# EasyEDA Pro project CTRL Paws.eprj

# Schematic Schematic1
Board Name: Board1; Create Date: 2026-03-21; Page Name: P1; Project Name: CTRL Paws; Schematic Name: Schematic1; Update Date: 2026-05-06; Company: EasyEDA.com; Page Size: A4; Version: V1.0
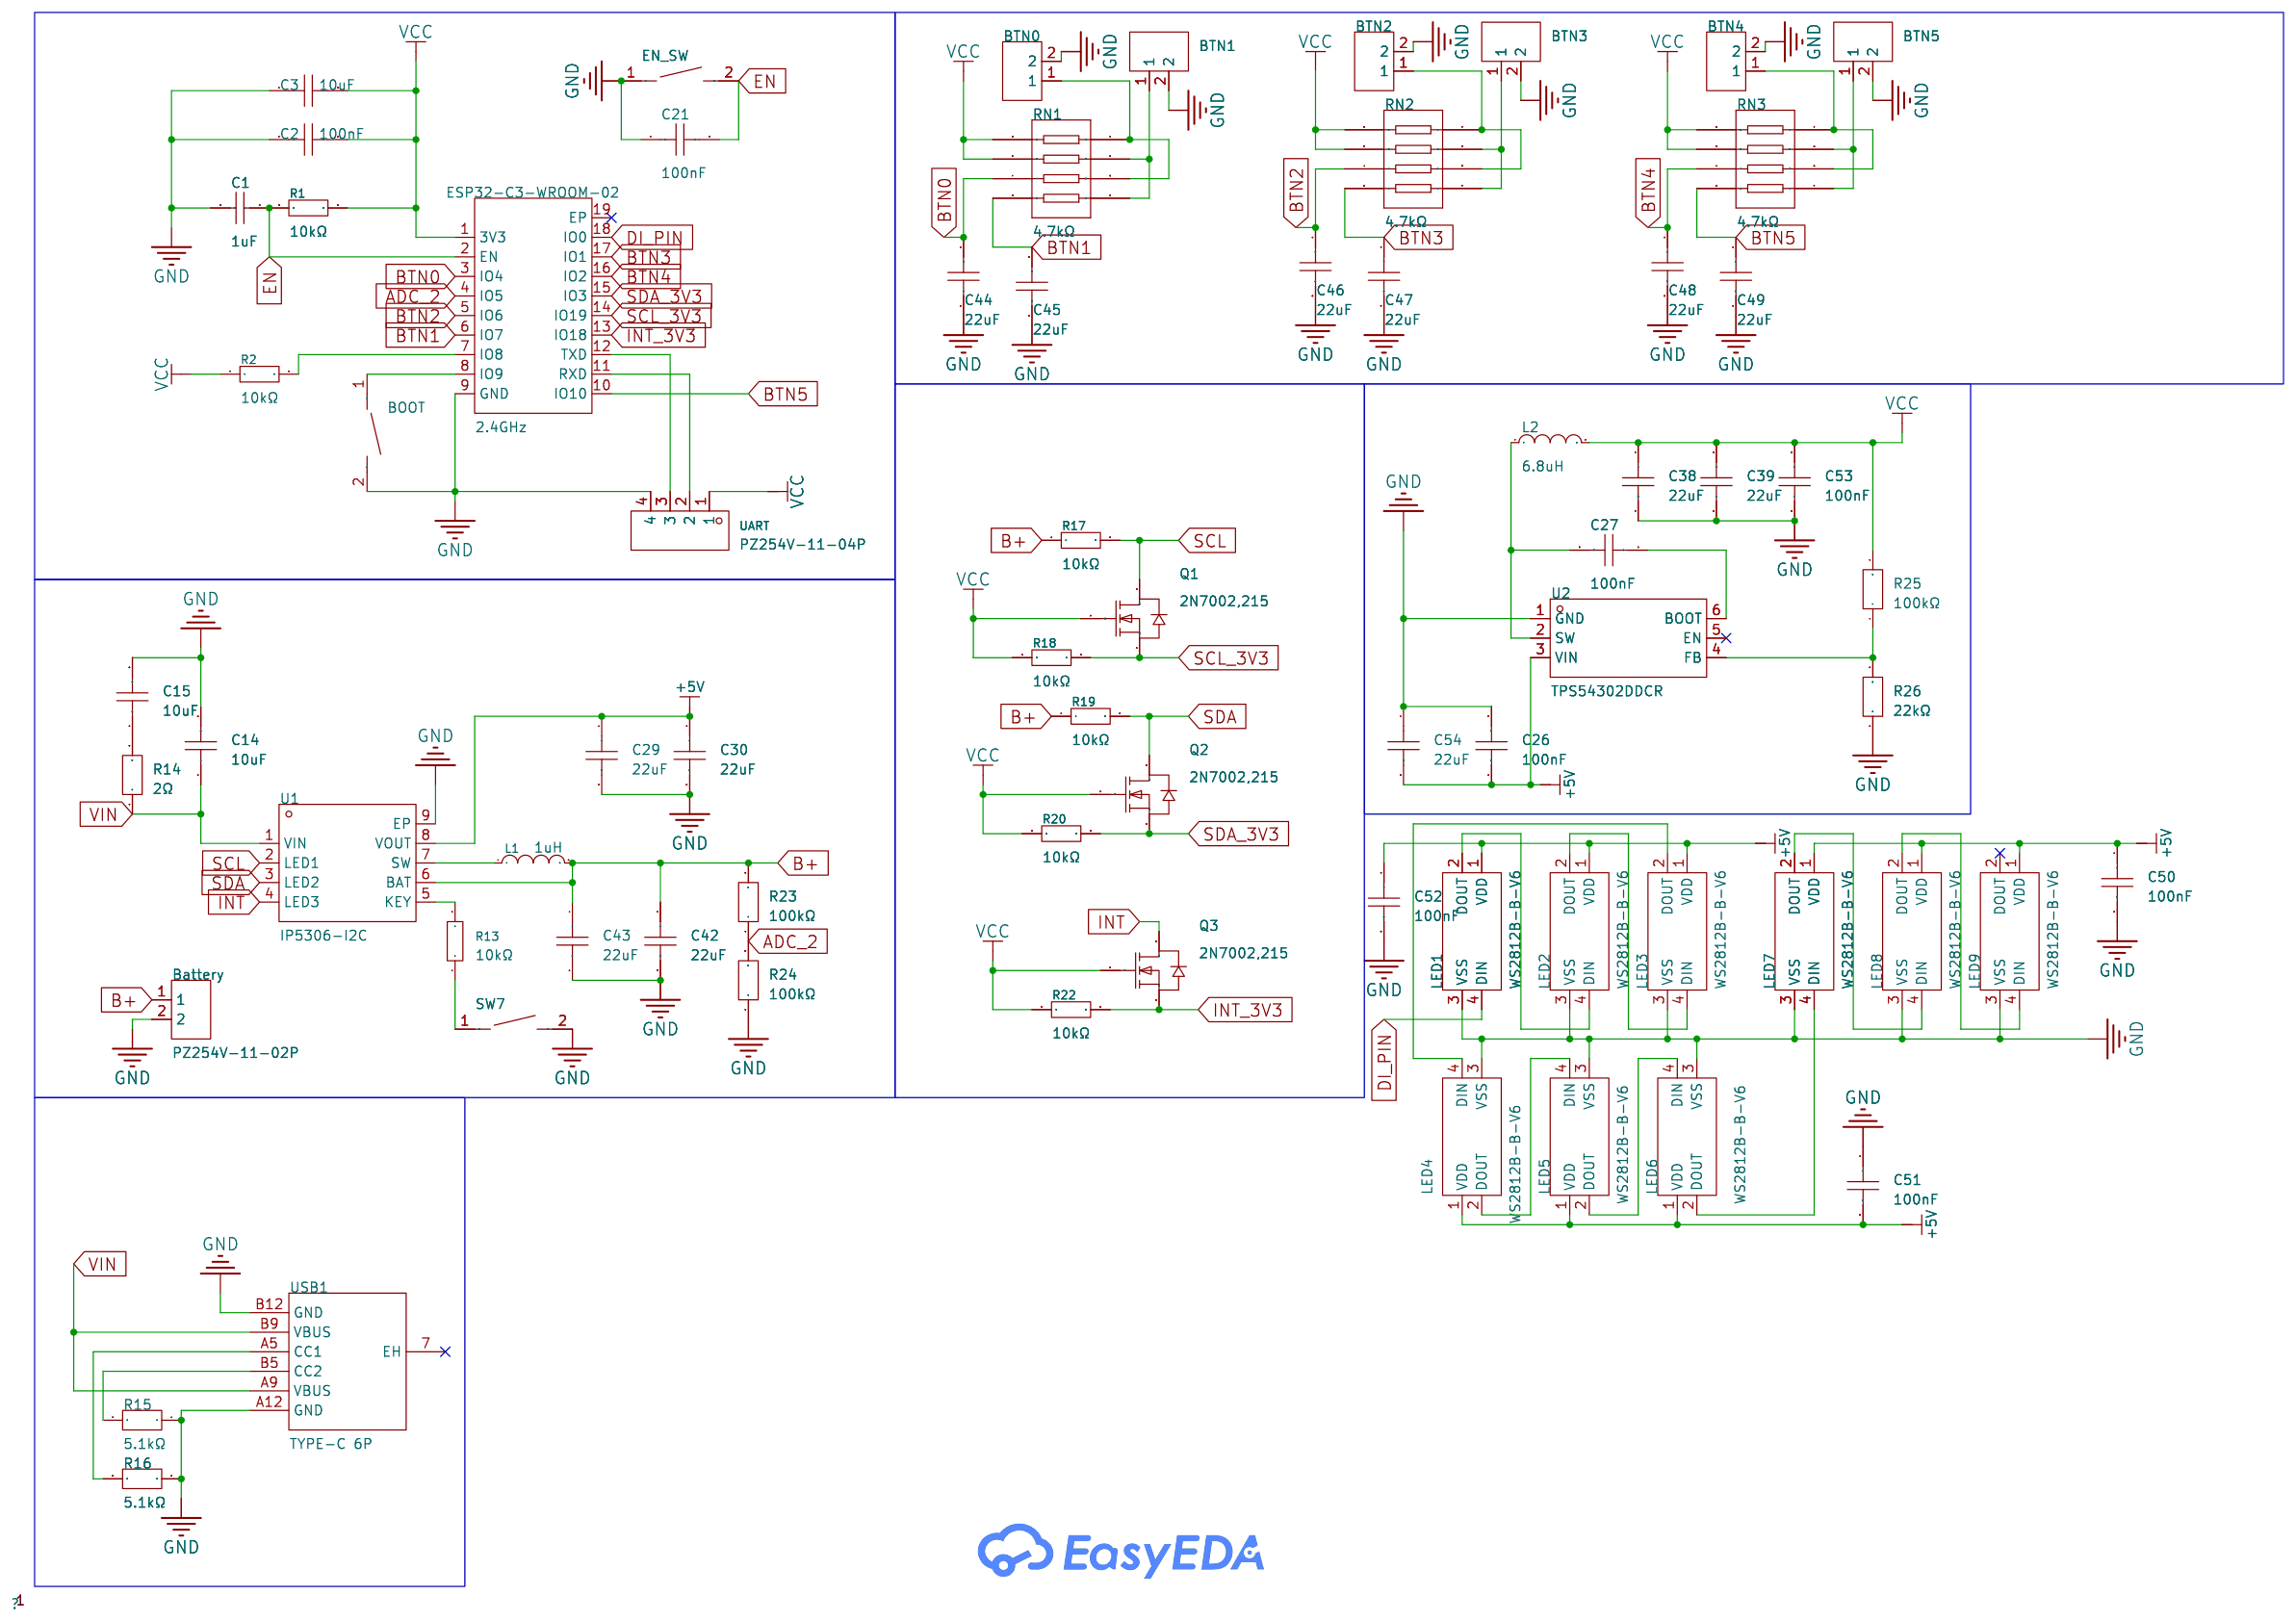
[diagram p0: schematic sheet]

## Parts
Battery  PZ254V-11-02P  [HDR-TH_2P-P2.54-V-M]
BOOT  TSA06154-050B832BA  [SW-TH_L6.1-W6.1-P5.00]
BTN0  PZ254V-11-02P  [HDR-TH_2P-P2.54-V-M]
BTN1  PZ254V-11-02P  [HDR-TH_2P-P2.54-V-M]
BTN2  PZ254V-11-02P  [HDR-TH_2P-P2.54-V-M]
BTN3  PZ254V-11-02P  [HDR-TH_2P-P2.54-V-M]
BTN4  PZ254V-11-02P  [HDR-TH_2P-P2.54-V-M]
BTN5  PZ254V-11-02P  [HDR-TH_2P-P2.54-V-M]
C1  1uF  [C0603]
C2  100nF  [C1206]
C3  10uF  [C0603]
C14  10uF  [C0603]
C15  10uF  [C0603]
C21  100nF  [C1206]
C26  100nF  [C1206]
C27  100nF  [C1206]
C29  22uF  [C0603]
C30  22uF  [C0603]
C38  22uF  [C0603]
C39  22uF  [C0603]
C42  22uF  [C0603]
C43  22uF  [C0603]
C44  22uF  [C0603]
C45  22uF  [C0603]
C46  22uF  [C0603]
C47  22uF  [C0603]
C48  22uF  [C0603]
C49  22uF  [C0603]
C50  100nF  [C1206]
C51  100nF  [C1206]
C52  100nF  [C1206]
C53  100nF  [C1206]
C54  22uF  [C0603]
EN_SW  TSA06154-050B832BA  [SW-TH_L6.1-W6.1-P5.00]
ESP32-C3-WROOM-02  2.4GHz  [BULETM-SMD_ESPRESSIF_ESP32-C3-WROOM-02-N4-4MB]
L1  1uH  [IND-SMD_L7.2-W6.6_GPSR07X0]
L2  6.8uH  [IND-SMD_L5.6-W5.2_DH0530H-100M]
LED1  WS2812B-B-V6  [LED-SMD_4P-L5.0-W5.0-TL_WS2812B-B]
LED2  WS2812B-B-V6  [LED-SMD_4P-L5.0-W5.0-TL_WS2812B-B]
LED3  WS2812B-B-V6  [LED-SMD_4P-L5.0-W5.0-TL_WS2812B-B]
LED4  WS2812B-B-V6  [LED-SMD_4P-L5.0-W5.0-TL_WS2812B-B]
LED5  WS2812B-B-V6  [LED-SMD_4P-L5.0-W5.0-TL_WS2812B-B]
LED6  WS2812B-B-V6  [LED-SMD_4P-L5.0-W5.0-TL_WS2812B-B]
LED7  WS2812B-B-V6  [LED-SMD_4P-L5.0-W5.0-TL_WS2812B-B]
LED8  WS2812B-B-V6  [LED-SMD_4P-L5.0-W5.0-TL_WS2812B-B]
LED9  WS2812B-B-V6  [LED-SMD_4P-L5.0-W5.0-TL_WS2812B-B]
Q1  2N7002,215  [SOT-23_L2.9-W1.3-P1.90-LS2.4-BR]
Q2  2N7002,215  [SOT-23_L2.9-W1.3-P1.90-LS2.4-BR]
Q3  2N7002,215  [SOT-23_L2.9-W1.3-P1.90-LS2.4-BR]
R1  10kΩ  [R1206]
R2  10kΩ  [R1206]
R13  10kΩ  [R1206]
R14  2Ω  [R1206]
R15  5.1kΩ  [R1206]
R16  5.1kΩ  [R1206]
R17  10kΩ  [R1206]
R18  10kΩ  [R1206]
R19  10kΩ  [R1206]
R20  10kΩ  [R1206]
R22  10kΩ  [R1206]
R23  100kΩ  [R0603]
R24  100kΩ  [R0603]
R25  100kΩ  [R0603]
R26  22kΩ  [R0603]
RN1  4.7kΩ  [RES-ARRAY-SMD_0603-8P-L3.2-W1.6-BL]
RN2  4.7kΩ  [RES-ARRAY-SMD_0603-8P-L3.2-W1.6-BL]
RN3  4.7kΩ  [RES-ARRAY-SMD_0603-8P-L3.2-W1.6-BL]
SW7  TSA06154-050B832BA  [SW-TH_L6.1-W6.1-P5.00]
U1  IP5306-I2C  [ESOP-8_L4.9-W3.9-P1.27-LS6.0-BL-EP2.0]
U2  TPS54302DDCR  [SOT-23-6_L2.9-W1.6-P0.95-LS2.8-BL]
UART  PZ254V-11-04P  [HDR-TH_4P-P2.54-V-M]
USB1  TYPE-C 6P  [TYPE-C-SMD_TYPE-C-6P_1]

## Library data of the parts
Battery BTN0-BTN5 = PZ254V-11-02P: LCSC Part Name: 1x2P 间距:2.54mm 方针 直插; Supplier Part: C492401; Manufacturer: XFCN(兴飞); Supplier Footprint: 插件,P=2.54mm; JLCPCB Part Class: Extended Part; Datasheet: https://item.szlcsc.com/datasheet/PZ254V-11-02P/502957.html; Supplier: LCSC; Pin Structure: 1x2P; Pitch: 2.54mm; Circluar Pins/Square Pins: Pin Header; Mounting Type: Through Hole; Number of Rows: 1; Number of Pins: 2P; Current Rating: 3A; Voltage Rating (Max): 250V; Length of Mating Pin: 6mm; Insulation Height: 2.5mm; Length of End Connection Pin: 3mm; Contact Material: Brass; Operating Temperature: -40℃~+105℃; Color: Black
BOOT EN_SW SW7 = TSA06154-050B832BA: LCSC Part Name: 6*6*5短两脚轻触开关250gf; Supplier Part: C49174414; Manufacturer: Khon(康宏电子); Supplier Footprint: 插件,6.1x6.1mm; JLCPCB Part Class: Extended Part; Datasheet: https://item.szlcsc.com/datasheet/TSA06154-050B832BA/51568440.html; Supplier: LCSC
C1 = CL10B105KO8NNNC: LCSC Part Name: 1uF ±10% 16V; Supplier Part: C59782; Manufacturer: SAMSUNG(三星); Supplier Footprint: 0603; JLCPCB Part Class: Extended Part; Datasheet: https://item.szlcsc.com/datasheet/CL10B105KO8NNNC/60834.html; Supplier: LCSC; Tolerance: ±10%; Voltage Rating: 16V; Temperature Coefficient: X7R
C2 C21 C26 C27 C50-C53 = CC1206KRX7R7BB104: LCSC Part Name: 100nF ±10% 16V; Supplier Part: C2180991; Manufacturer: YAGEO(国巨); Supplier Footprint: 1206; JLCPCB Part Class: Extended Part; Datasheet: https://item.szlcsc.com/datasheet/CC1206KRX7R7BB104/2273058.html; Supplier: LCSC; Tolerance: ±10%; Voltage Rating: 16V; Temperature Coefficient: X7R
C3 C14 C15 = CL10A106KO8NQNC: LCSC Part Name: 10uF ±10% 16V; Supplier Part: C962136; Manufacturer: SAMSUNG(三星); Supplier Footprint: 0603; JLCPCB Part Class: Extended Part; Datasheet: https://item.szlcsc.com/datasheet/CL10A106KO8NQNC/1043176.html; Supplier: LCSC; Tolerance: ±10%; Voltage Rating: 16V; Temperature Coefficient: X5R
C29 C30 C38 C39 C42-C49 C54 = CL10A226MO7JZNC: LCSC Part Name: 22uF ±20% 16V; Supplier Part: C2762594; Manufacturer: SAMSUNG(三星); Supplier Footprint: 0603; JLCPCB Part Class: Extended Part; Datasheet: https://item.szlcsc.com/datasheet/CL10A226MO7JZNC/2889856.html; Supplier: LCSC; Tolerance: ±20%; Voltage Rating: 16V; Temperature Coefficient: X5R
ESP32-C3-WROOM-02 = ESP32-C3-WROOM-02-N4_C2934560: LCSC Part Name: 不带固件 2.4GHz Wi-Fi（802.11b/g/n）+ 蓝牙5模组; Supplier Part: C2934560; Manufacturer: ESPRESSIF(乐鑫); Manufacturer Part: ESP32-C3-WROOM-02-N4; Supplier Footprint: VFQFN-32-EP; JLCPCB Part Class: Extended Part; Datasheet: https://item.szlcsc.com/datasheet/ESP32-C3-WROOM-02-N4/3281215.html; Supplier: LCSC; Utilized IC / Part: ESP32-C3 Chip; Wireless Standard: Bluetooth5.0; Interface Type: I2S；I2C；JTAG；UART；USB；SPI; Antenna Type: On-board PCB Antenna; Output Power: 20.5dBm; Voltage - Supply: 3V~3.6V; Receive  Current: 82mA; Send  Current: 345mA; Sensitivity: -105dBm; Operating Temperature: -40℃~+85℃
L1 = CYA0650-1.0UH: LCSC Part Name: 1uH ±20%; Supplier Part: C5189750; Manufacturer: SHOU HAN(首韩); Supplier Footprint: SMD,7.2x6.6mm; JLCPCB Part Class: Extended Part; Datasheet: https://atta.szlcsc.com/upload/public/pdf/source/20221010/325EA9F909CAF5AD1FA67C845DC4B396.pdf; Supplier: LCSC; Tolerance: ±20%
L2 = DH0530H-6R8M: LCSC Part Name: DH0530H-6R8M（6.8uH); Supplier Part: C41407037; Manufacturer: DH(德鸿感应); Supplier Footprint: SMD,5.6x5.2mm; JLCPCB Part Class: Extended Part; Datasheet: https://item.szlcsc.com/datasheet/DH0530H-6R8M/43206053.html; Supplier: LCSC; Tolerance: ±20%; Current Rating: 3A; Current - Saturation(Isat): 5A; DC Resistance(DCR): 70mΩ; Type: Molded Inductor
LED1-LED9 = WS2812B-B-V6: Supplier Part: C52941391; Manufacturer: worldsemi; Supplier Footprint: SMD5050-4P; JLCPCB Part Class: Extended Part; Datasheet: https://item.szlcsc.com/datasheet/WS2812B-B-V6/55856754.html; Supplier: LCSC
Q1-Q3 = 2N7002,215: LCSC Part Name: 1个N沟道 耐压:60V 电流:300mA; Supplier Part: C65189; Manufacturer: Nexperia(安世); Supplier Footprint: SOT-23; JLCPCB Part Class: Extended Part; Datasheet: https://item.szlcsc.com/datasheet/2N7002%252C215/66260.html; Supplier: LCSC; Number: 1 N-Channel; Drain to Source Voltage: 60V; Current - Continuous Drain(Id): 300mA; RDS(on): 5Ω@10V,500mA; Pd - Power Dissipation: 830mW; Gate Threshold Voltage (Vgs(th)): 2.5V; Input Capacitance(Ciss): 50pF@10V; Operating Temperature: -65℃~+150℃@(Tj)
R1 R2 R13 R17-R20 R22 = 1206W4F1002T5E: LCSC Part Name: 10kΩ ±1% 250mW 厚膜电阻; Supplier Part: C17902; Manufacturer: UNI-ROYAL(厚声); Supplier Footprint: 1206; JLCPCB Part Class: Basic Part; Datasheet: https://item.szlcsc.com/datasheet/1206W4F1002T5E/18590.html; Supplier: LCSC; Type: Thick Film Resistor; Tolerance: ±1%; Power(Watts): 250mW; Voltage-Supply(Max): 200V; Temperature Coefficient: ±100ppm/℃; Operating Temperature: -55℃~+155℃
R14 = FRC1206F2R00TS: LCSC Part Name: 2Ω ±1% 250mW 厚膜电阻; Supplier Part: C2907381; Manufacturer: FOJAN(富捷); Supplier Footprint: 1206; JLCPCB Part Class: Extended Part; Supplier: LCSC; Type: Thick Film Resistor; Tolerance: ±1%; Power(Watts): 250mW; Voltage-Supply(Max): 200V; Temperature Coefficient: ±200ppm/℃; Operating Temperature: -55℃~+155℃
R15 R16 = FRC1206J512 TS: LCSC Part Name: 5.1kΩ ±5% 250mW 厚膜电阻; Supplier Part: C2907509; Manufacturer: FOJAN(富捷); Supplier Footprint: 1206; JLCPCB Part Class: Extended Part; Supplier: LCSC; Type: Thick Film Resistor; Tolerance: ±5%; Power(Watts): 250mW; Voltage-Supply(Max): 200V; Temperature Coefficient: ±100ppm/℃; Operating Temperature: -55℃~+155℃
R23-R25 = FRC0603J104 TS: LCSC Part Name: 100kΩ ±5% 100mW 厚膜电阻; Supplier Part: C2907088; Manufacturer: FOJAN(富捷); Supplier Footprint: 0603; JLCPCB Part Class: Extended Part; Supplier: LCSC; Type: Thick Film Resistor; Tolerance: ±5%; Power(Watts): 100mW; Voltage-Supply(Max): 75V; Temperature Coefficient: ±100ppm/℃; Operating Temperature: -55℃~+155℃
R26 = FRC0603F2202TS: LCSC Part Name: 22kΩ ±1% 100mW 厚膜电阻; Supplier Part: C2907015; Manufacturer: FOJAN(富捷); Supplier Footprint: 0603; JLCPCB Part Class: Extended Part; Supplier: LCSC; Type: Thick Film Resistor; Tolerance: ±1%; Power(Watts): 100mW; Voltage-Supply(Max): 75V; Temperature Coefficient: ±100ppm/℃; Operating Temperature: -55℃~+155℃
RN1-RN3 = YC164-JR-074K7L: LCSC Part Name: 4.7kΩ ±5%; Supplier Part: C327044; Manufacturer: YAGEO(国巨); Supplier Footprint: 0603x4; JLCPCB Part Class: Extended Part; Datasheet: https://item.szlcsc.com/datasheet/YC164-JR-074K7L/307138.html; Supplier: LCSC; Tolerance: ±5%; Power(Watts): 62.5mW; Temperature Coefficient: ±200ppm/℃
U1 = IP5306-I2C: LCSC Part Name: 2.1A充电 2.4A放电高集成度移动电源SOC; Supplier Part: C488349; Manufacturer: INJOINIC(英集芯); Supplier Footprint: ESOP-8; JLCPCB Part Class: Extended Part; Datasheet: https://item.szlcsc.com/datasheet/IP5306-I2C/497969.html; Supplier: LCSC; The Chip Type: Charging IC; Voltage - Supply: 4.75V~5.5V; Charge Current - Max: 2.1A; Charging Saturation Voltage: 4.2V; Type of Battery: Lithium Battery; Operating Temperature: 0℃~+70℃; Battery Temperature Detection: Not supported; 0V Battery Charge: Not supported; Supply Current (Iq): 100uA; Interface: I2C; Features: Overcurrent Protection；Constant voltage charging；Constant current charging；Automatic recharge；Charge termination；Programmable charging current；Overvoltage protection；Over-discharge protection；Trickle charging；Short-Circuit  Protection
U2 = TPS54302DDCR_C311983: LCSC Part Name: 4.5V至28V输入、3A输出、EMI友好的同步降压转换器; Supplier Part: C311983; Manufacturer: TI(德州仪器); Supplier Footprint: TSOT-23-6; JLCPCB Part Class: Extended Part; Datasheet: https://www.ti.com/cn/lit/gpn/tps54302; Supplier: LCSC; Function: Step-down type; Output Type: Fixed; Input Voltage: 4.5V~28V; Output Voltage: 5V; Output Current: 3A; Switching Frequency: 400kHz; Operating Temperature: -40℃~+125℃; Synchronous Rectification: Yes; Number of Outputs: 1; Topology: Step-down; Quiescent Current (Iq): 45uA; Switch tube (built-in/external): Built-in
UART = PZ254V-11-04P: LCSC Part Name: 1x4P 间距:2.54mm 方针 直插; Supplier Part: C2691448; Manufacturer: XFCN(兴飞); Supplier Footprint: 插件,P=2.54mm; JLCPCB Part Class: Extended Part; Datasheet: https://item.szlcsc.com/datasheet/PZ254V-11-04P/2801085.html; Supplier: LCSC; Pin Structure: 1x4P; Pitch: 2.54mm; Circluar Pins/Square Pins: Pin Header; Mounting Type: Through Hole; Number of Rows: 1; Number of Pins: 4P; Current Rating: 3A; Voltage Rating (Max): 250V; Length of Mating Pin: 6mm; Insulation Height: 2.5mm; Length of End Connection Pin: 3mm; Operating Temperature: -40℃~+105℃; Color: Black
USB1 = TYPE-C 6P: LCSC Part Name: 6P卧贴母座; Supplier Part: C456012; Manufacturer: SHOU HAN(首韩); Supplier Footprint: SMD; JLCPCB Part Class: Extended Part; Datasheet: https://item.szlcsc.com/datasheet/TYPE-C%25206P/458819.html; Supplier: LCSC; Connector Type: Type-C; Gender: Female; Mounting Type: Surface Mount, Right Angle; Number of Contacts: 6P; Number of Ports: 1; Current Rating-Power: 3A; Voltage Rating: 5V; Connect-Disconnect Life: 3,000 Cycles; Detection color: Black; Operating Temperature: -40℃~+85℃

## Nets
+5V: C26.1 C29.1 C30.1 C50.1 C51.2 C52.1 C54.2 LED1.1(VDD) LED2.1(VDD) LED3.1(VDD) LED4.1(VDD) LED5.1(VDD) LED6.1(VDD) LED7.1(VDD) LED8.1(VDD) LED9.1(VDD) U1.8(VOUT) U2.3(VIN)
GND: Battery.2 BOOT.2 BTN0.2 BTN1.2 BTN2.2 BTN3.2 BTN4.2 BTN5.2 C1.1 C2.1 C3.1 C14.2 C15.2 C21.1 C26.2 C29.2 C30.2 C38.2 C39.2 C42.2 C43.2 C44.2 C45.2 C46.2 C47.2 C48.2 C49.2 C50.2 C51.1 C52.2 C53.1 C54.1 EN_SW.1 ESP32-C3-WROOM-02.9(GND) LED1.3(VSS) LED2.3(VSS) LED3.3(VSS) LED4.3(VSS) LED5.3(VSS) LED6.3(VSS) LED7.3(VSS) LED8.3(VSS) LED9.3(VSS) R15.1 R16.1 R24.1 R26.1 SW7.2 U1.9(EP) U2.1(GND) UART.4 USB1.A12(GND) USB1.B12(GND)
VCC: C2.2 C3.2 C38.1 C39.1 C53.2 ESP32-C3-WROOM-02.1(3V3) L2.2 Q1.1(G) Q2.1(G) Q3.1(G) R1.2 R2.1 R18.1 R20.1 R22.1 R25.2 RN1.5 RN1.6 RN2.5 RN2.6 RN3.5 RN3.6 UART.1
VIN: C14.1 R14.1 U1.1(VIN) USB1.A9(VBUS) USB1.B9(VBUS)
ADC_2: ESP32-C3-WROOM-02.4(IO5) R23.1 R24.2
B+: Battery.1 C42.1 C43.1 L1.2 R17.1 R19.1 R23.2 U1.6(BAT)
BTN0: C44.1 ESP32-C3-WROOM-02.3(IO4) RN1.7
BTN1: C45.1 ESP32-C3-WROOM-02.6(IO7) RN1.8
BTN2: C46.1 ESP32-C3-WROOM-02.5(IO6) RN2.7
BTN3: C47.1 ESP32-C3-WROOM-02.17(IO1) RN2.8
BTN4: C48.1 ESP32-C3-WROOM-02.16(IO2) RN3.7
BTN5: C49.1 ESP32-C3-WROOM-02.10(IO10) RN3.8
DI_PIN: ESP32-C3-WROOM-02.18(IO0) LED1.4(DIN)
EN: C1.2 C21.2 EN_SW.2 ESP32-C3-WROOM-02.2(EN) R1.1
INT: Q3.3(D) U1.4(LED3)
INT_3V3: ESP32-C3-WROOM-02.13(IO18) Q3.2(S) R22.2
SCL: Q1.3(D) R17.2 U1.2(LED1)
SCL_3V3: ESP32-C3-WROOM-02.14(IO19) Q1.2(S) R18.2
SDA: Q2.3(D) R19.2 U1.3(LED2)
SDA_3V3: ESP32-C3-WROOM-02.15(IO3) Q2.2(S) R20.2
$1N2784: ESP32-C3-WROOM-02.7(IO8) R2.2
$1N4891: BOOT.1 ESP32-C3-WROOM-02.8(IO9)
$1N6349: L1.1 U1.7(SW)
$1N6507: R13.2 U1.5(KEY)
$1N6541: R13.1 SW7.1
$1N6731: C15.1 R14.2
$1N8374: R15.2 USB1.B5(CC2)
$1N8380: R16.2 USB1.A5(CC1)
$1N10278: C27.2 L2.1 U2.2(SW)
$1N10381: R25.1 R26.2 U2.4(FB)
$1N10452: C27.1 U2.6(BOOT)
$1N11511: LED4.2(DOUT) LED5.4(DIN)
$1N11517: LED5.2(DOUT) LED6.4(DIN)
$1N11524: LED6.2(DOUT) LED7.4(DIN)
$1N11575: LED7.2(DOUT) LED8.4(DIN)
$1N11589: LED8.2(DOUT) LED9.4(DIN)
$1N11601: LED1.2(DOUT) LED2.4(DIN)
$1N11617: LED2.2(DOUT) LED3.4(DIN)
$1N11630: LED3.2(DOUT) LED4.4(DIN)
$1N11984: ESP32-C3-WROOM-02.11(RXD) UART.2
$1N11989: ESP32-C3-WROOM-02.12(TXD) UART.3
$1N25047: BTN1.1 RN1.1 RN1.3
$1N25198: BTN0.1 RN1.2 RN1.4
$1N27953: BTN3.1 RN2.1 RN2.3
$1N27956: BTN2.1 RN2.2 RN2.4
$1N28261: BTN5.1 RN3.1 RN3.3
$1N28264: BTN4.1 RN3.2 RN3.4

Not connected (* = marked no-connect by the designer): ESP32-C3-WROOM-02 19(EP)*; LED9 2(DOUT)*; U2 5(EN)*; USB1 7(EH)*

# Board PCB1
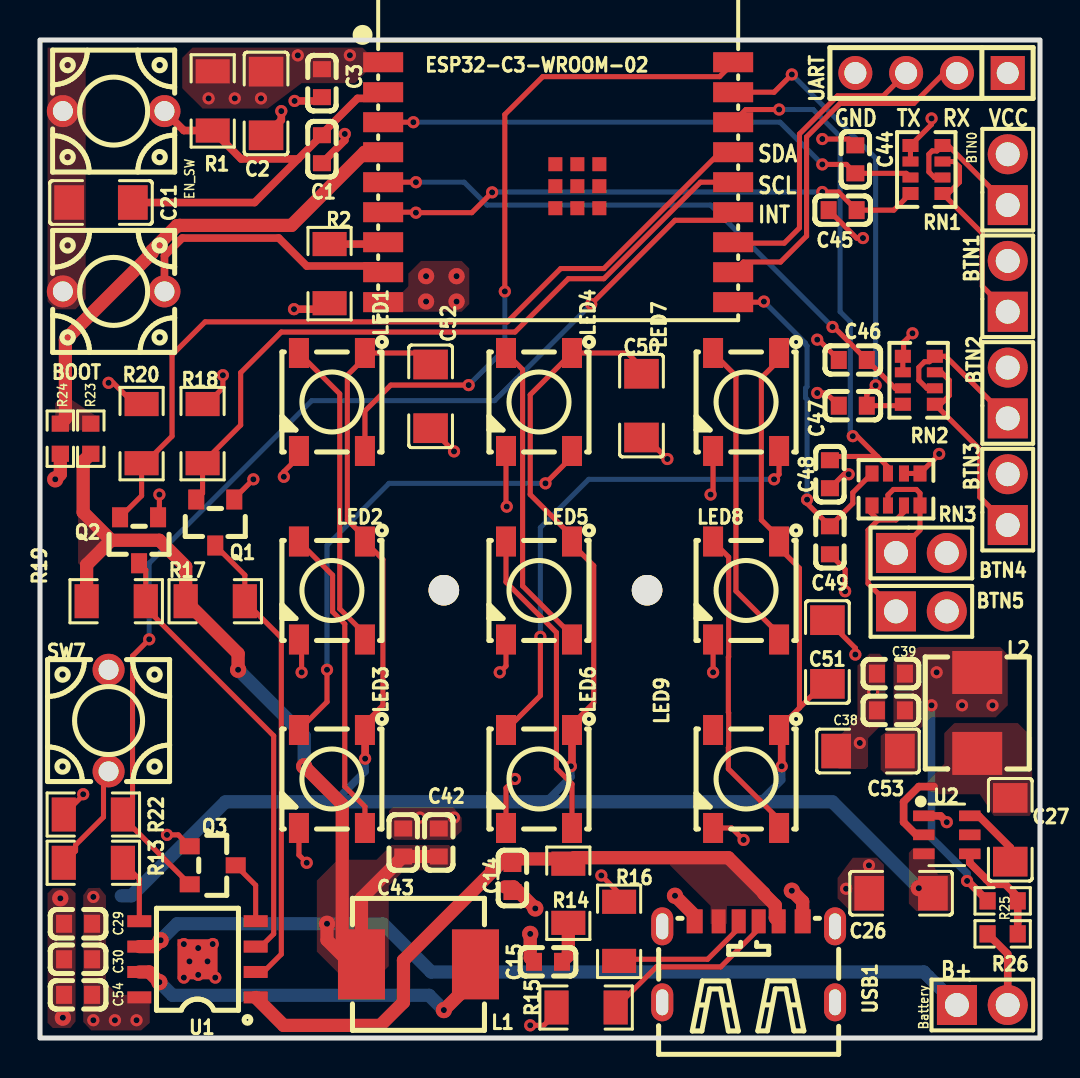
[diagram p1: board, top side]
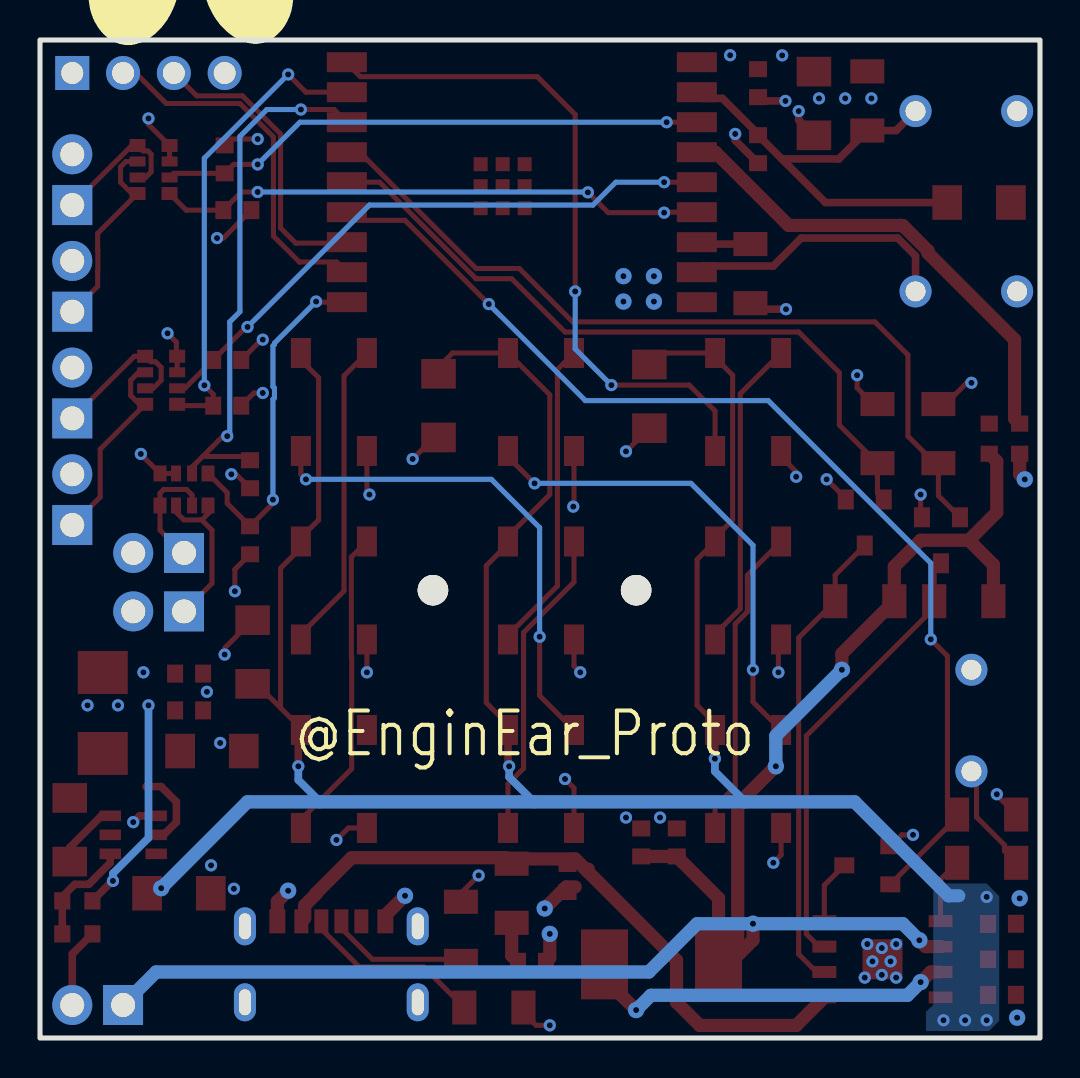
[diagram p2: board, bottom side, seen from below]

Outline 50 x 49.91 mm; copper layers: Top Layer, Inner1, Inner2, Bottom Layer. Coordinates in mm from the lower left corner of the outline.
Outline path: rectangle 0,49.91 50,0
Stack: Top Layer 0.035mm Outer layer thickness 1oz / Dielectric1 0.2104mm 7628 RC49% 8.6mil / Inner1 0.0152mm Inner layer thickness / Dielectric2 1.065mm 1.1mm H/HOZ Copper / Inner2 0.0152mm Inner layer thickness / Dielectric3 0.2104mm 7628 RC49% 8.6mil / Bottom Layer 0.035mm Outer layer thickness 1oz

## Design rules (mm)
template: Custom Config
spacing copperThickness1oz (default): track to track 0.102, other pairs 0.152 to 0.3
spacing copperThickness2oz: track to track 0.203, other pairs 0.152 to 0.3
track width copperThickness1oz (default): min 0.127, default 0.254, max 2.54
track width copperThickness2oz: min 0.203, default 0.254, max 2.54
differential pair differentialPair (default): width min 0.127, default 0.254, max 2.54; gap min 0.152, default 0.152
via viaSize (default): diameter min 0.5, default 0.61, max 10; hole min 0.3, default 0.305, max 6.3

## Placement (name value [footprint] x y rotation side)
Battery  PZ254V-11-02P  [HDR-TH_2P-P2.54-V-M]  47.12 1.65 0 top
BOOT  TSA06154-050B832BA  [SW-TH_L6.1-W6.1-P5.00]  3.68 37.34 180 top
BTN0  PZ254V-11-02P  [HDR-TH_2P-P2.54-V-M]  48.39 42.93 90 top
BTN1  PZ254V-11-02P  [HDR-TH_2P-P2.54-V-M]  48.39 37.59 90 top
BTN2  PZ254V-11-02P  [HDR-TH_2P-P2.54-V-M]  48.39 32.26 90 top
BTN3  PZ254V-11-02P  [HDR-TH_2P-P2.54-V-M]  48.39 26.92 90 top
BTN4  PZ254V-11-02P  [HDR-TH_2P-P2.54-V-M]  44.07 24.26 0 top
BTN5  PZ254V-11-02P  [HDR-TH_2P-P2.54-V-M]  44.07 21.34 0 top
C1  1uF  [C0603]  14.1 44.45 90 top
C2  100nF  [C1206]  11.3 46.74 90 top
C3  10uF  [C0603]  14.1 47.75 90 top
C14  10uF  [C0603]  23.62 8 270 top
C15  10uF  [C0603]  25.4 3.81 180 top
C21  100nF  [C1206]  3.05 41.78 0 top
C26  100nF  [C1206]  43.05 7.24 180 top
C27  100nF  [C1206]  48.51 10.41 90 top
C29  22uF  [C0603]  1.91 5.72 180 top
C30  22uF  [C0603]  1.91 3.94 180 top
C38  22uF  [C0603]  42.54 16.38 180 top
C39  22uF  [C0603]  42.54 18.22 180 top
C42  22uF  [C0603]  19.94 9.78 90 top
C43  22uF  [C0603]  18.16 9.78 90 top
C44  22uF  [C0603]  40.77 43.94 90 top
C45  22uF  [C0603]  40.13 41.4 180 top
C46  22uF  [C0603]  40.64 33.91 180 top
C47  22uF  [C0603]  40.64 31.62 180 top
C48  22uF  [C0603]  39.5 28.19 270 top
C49  22uF  [C0603]  39.5 24.89 270 top
C50  100nF  [C1206]  30.07 31.63 270 top
C51  100nF  [C1206]  39.37 19.3 270 top
C52  100nF  [C1206]  19.53 32.09 270 top
C53  100nF  [C1206]  41.4 14.35 0 top
C54  22uF  [C0603]  1.91 2.16 0 top
EN_SW  TSA06154-050B832BA  [SW-TH_L6.1-W6.1-P5.00]  3.68 46.36 0 top
ESP32-C3-WROOM-02  2.4GHz  [BULETM-SMD_ESPRESSIF_ESP32-C3-WROOM-02-N4-4MB]  25.91 42.8 0 top
L1  1uH  [IND-SMD_L7.2-W6.6_GPSR07X0]  18.92 3.68 180 top
L2  6.8uH  [IND-SMD_L5.6-W5.2_DH0530H-100M]  46.86 16.26 90 top
LED1  WS2812B-B-V6  [LED-SMD_4P-L5.0-W5.0-TL_WS2812B-B]  14.6 31.81 270 top
LED2  WS2812B-B-V6  [LED-SMD_4P-L5.0-W5.0-TL_WS2812B-B]  14.6 22.38 270 top
LED3  WS2812B-B-V6  [LED-SMD_4P-L5.0-W5.0-TL_WS2812B-B]  14.6 12.95 270 top
LED4  WS2812B-B-V6  [LED-SMD_4P-L5.0-W5.0-TL_WS2812B-B]  24.95 31.81 270 top
LED5  WS2812B-B-V6  [LED-SMD_4P-L5.0-W5.0-TL_WS2812B-B]  24.95 22.38 270 top
LED6  WS2812B-B-V6  [LED-SMD_4P-L5.0-W5.0-TL_WS2812B-B]  24.95 12.95 270 top
LED7  WS2812B-B-V6  [LED-SMD_4P-L5.0-W5.0-TL_WS2812B-B]  35.3 31.81 270 top
LED8  WS2812B-B-V6  [LED-SMD_4P-L5.0-W5.0-TL_WS2812B-B]  35.3 22.38 270 top
LED9  WS2812B-B-V6  [LED-SMD_4P-L5.0-W5.0-TL_WS2812B-B]  35.3 12.95 270 top
NOREF  -  [Pad_e1553]  20.19 22.39 90 top
NOREF#2  -  [Pad_e1554]  30.35 22.39 90 top
Q1  2N7002,215  [SOT-23_L2.9-W1.3-P1.90-LS2.4-BR]  8.76 25.78 90 top
Q2  2N7002,215  [SOT-23_L2.9-W1.3-P1.90-LS2.4-BR]  4.95 24.89 90 top
Q3  2N7002,215  [SOT-23_L2.9-W1.3-P1.90-LS2.4-BR]  8.64 8.64 180 top
R1  10kΩ  [R1206]  8.64 46.86 90 top
R2  10kΩ  [R1206]  14.48 38.23 90 top
R13  10kΩ  [R1206]  2.67 8.76 0 top
R14  2Ω  [R1206]  26.42 7.24 270 top
R15  5.1kΩ  [R1206]  27.31 1.52 0 top
R16  5.1kΩ  [R1206]  28.96 5.33 270 top
R17  10kΩ  [R1206]  8.76 21.84 0 top
R18  10kΩ  [R1206]  8.13 30.23 270 top
R19  10kΩ  [R1206]  3.81 21.84 0 top
R20  10kΩ  [R1206]  5.08 30.23 270 top
R22  10kΩ  [R1206]  2.67 11.18 0 top
R23  100kΩ  [R0603]  2.54 29.97 270 top
R24  100kΩ  [R0603]  1.02 29.97 90 top
R25  100kΩ  [R0603]  48.13 6.86 180 top
R26  22kΩ  [R0603]  48.13 5.21 0 top
RN1  4.7kΩ  [RES-ARRAY-SMD_0603-8P-L3.2-W1.6-BL]  44.32 43.43 90 top
RN2  4.7kΩ  [RES-ARRAY-SMD_0603-8P-L3.2-W1.6-BL]  43.94 32.89 90 top
RN3  4.7kΩ  [RES-ARRAY-SMD_0603-8P-L3.2-W1.6-BL]  42.8 27.43 0 top
SW7  TSA06154-050B832BA  [SW-TH_L6.1-W6.1-P5.00]  3.43 15.88 90 top
U1  IP5306-I2C  [ESOP-8_L4.9-W3.9-P1.27-LS6.0-BL-EP2.0]  7.87 3.94 90 top
U2  TPS54302DDCR  [SOT-23-6_L2.9-W1.6-P0.95-LS2.8-BL]  45.34 10.16 270 top
UART  PZ254V-11-04P  [HDR-TH_4P-P2.54-V-M]  44.58 48.26 180 top
USB1  TYPE-C 6P  [TYPE-C-SMD_TYPE-C-6P_1]  35.43 3.81 0 top

## Footprints (pads in the part's own frame, mm; a bottom-side part is the same pattern mirrored in y, then rotated)
BULETM-SMD_ESPRESSIF_ESP32-C3-WROOM-02-N4-4MB
  rect 2x1 smd: 1(-8.75,6) 2(-8.75,4.5) 3(-8.75,3) 4(-8.75,1.5) 5(-8.75,0) 6(-8.75,-1.5) 7(-8.75,-3) 8(-8.75,-4.5) 9(-8.75,-6) 10(8.75,-6) 11(8.75,-4.5) 12(8.75,-3) 13(8.75,-1.5) 14(8.75,0) 15(8.75,1.5) 16(8.75,3) 17(8.75,4.5) 18(8.75,6)
  rect 0.7x0.7 smd: 19(-0.14,0.9) 19(-0.14,-0.2) 19(-0.14,-1.3) 19(0.96,0.9) 19(0.96,-0.2) 19(0.96,-1.3) 19(2.06,0.9) 19(2.06,-0.2) 19(2.06,-1.3)
C0603
  rect 0.8x0.9 smd: 1(-0.7,0) 2(0.7,0)
C1206
  rect 1.485x1.728 smd: 1(-1.593,0) 2(1.593,0)
ESOP-8_L4.9-W3.9-P1.27-LS6.0-BL-EP2.0
  rect 0.6x1.2 smd: 1(-1.905,-2.909) 2(-0.635,-2.909) 3(0.635,-2.909) 4(1.905,-2.909) 5(1.905,2.909) 6(0.635,2.909) 7(-0.635,2.909) 8(-1.905,2.909)
  rect 2x2 smd: 9(0,0)
HDR-TH_2P-P2.54-V-M
  rect 2x2 hole 1.2: 1(-1.27,0)
  round 2 hole 1.2: 2(1.27,0)
HDR-TH_4P-P2.54-V-M
  rect 1.7x1.7 hole 1.1: 1(-3.81,0)
  round 1.7 hole 1.1: 2(-1.27,0) 3(1.27,0) 4(3.81,0)
IND-SMD_L5.6-W5.2_DH0530H-100M
  rect 2.15x2.5 smd: 1(-2.025,0) 2(2.025,0)
IND-SMD_L7.2-W6.6_GPSR07X0
  rect 2.35x3.5 smd: 1(-2.85,0) 2(2.85,0)
LED-SMD_4P-L5.0-W5.0-TL_WS2812B-B
  rect 1.5x1 smd: 1(-2.45,1.65) 2(-2.45,-1.65) 3(2.45,-1.65) 4(2.45,1.65)
Pad_e1553
  round 1.524 hole 10x3: 1(0,0)
Pad_e1554
  round 1.524 hole 10x3: 2(0,0)
R0603
  rect 0.806x0.864 smd: 1(-0.753,0) 2(0.753,0)
R1206
  rect 1.208x1.701 smd: 1(-1.479,0) 2(1.479,0)
RES-ARRAY-SMD_0603-8P-L3.2-W1.6-BL
  rect 0.65x0.8 smd: 1(-1.2,-0.8) 4(1.2,-0.8) 5(1.2,0.8) 8(-1.2,0.8)
  rect 0.5x0.8 smd: 2(-0.4,-0.8) 3(0.4,-0.8) 6(0.4,0.8) 7(-0.4,0.8)
SOT-23-6_L2.9-W1.6-P0.95-LS2.8-BL
  rect 0.532x1.072 smd: 1(-0.95,-1.149) 2(0,-1.149) 3(0.95,-1.149) 4(0.95,1.149) 5(0,1.149) 6(-0.95,1.149)
SOT-23_L2.9-W1.3-P1.90-LS2.4-BR
  rect 1x0.8 smd: 1(1.15,-0.95) 2(1.15,0.95) 3(-1.15,0)
SW-TH_L6.1-W6.1-P5.00
  round 1.6 hole 1: 1(-2.54,0) 2(2.54,0)
TYPE-C-SMD_TYPE-C-6P_1
  oval 1.1x1.9 hole 0.6x1.3: 7(-4.32,1.775) 7(-4.32,-2.025) 7(4.32,1.775) 7(4.32,-2.025)
  rect 0.7x1.2 smd: A5(-0.5,2.025) A9(1.5,2.025) B5(0.5,2.025) B9(-1.5,2.025)
  rect 0.8x1.2 smd: A12(2.7,2.025) B12(-2.7,2.025)

## Nets
As in the schematic.

Pads without a net: ESP32-C3-WROOM-02 19; LED9 2; NOREF 1; NOREF#2 2; U2 5; USB1 7

## Via types
v1: diameter 0.813, hole 0.305, Top Layer to Bottom Layer, 18 vias
v2: diameter 0.61, hole 0.305, Top Layer to Bottom Layer, 86 vias

## Routing (per net, layer and track width the routed paths; a pad name or vN(x,y) marks a point on that pad's centre or on a via; arc(x,y) is an arc through that point)
+5V: length 127.2
  Top Layer w0.254: LED7.1 36.95,33.91 36.07,33.02 36.07,25.91 36.95,25.02 LED8.1 36.95,24.51 37.97,23.5 37.97,16.51 ; LED9.1 36.95,15.49 37.97,16.51 ; LED6.1 26.6,15.68 27.69,16.76 27.69,23.62 26.6,24.71 LED5.1 26.6,25.09 24.51,27.18 24.51,32.17 LED4.1 29.37,34.26 29.72,33.91 ; LED3.1 16.25,15.74 17.15,16.64 17.15,23.93 LED2.1 16.25,25.03 15.37,25.91 15.37,33.15 16.25,34.03 LED1.1 19.41,34.26 19.81,33.85 ; 37.97,16.51 39.17,17.71 C51.2
  Top Layer w0.381: v2(37.08,13.59) 37.08,15.27 LED9.1 ; v2(16.26,13.97) 16.26,15.39 LED3.1 ; v2(26.54,13.59) 26.6,13.65 LED6.1
  Bottom Layer w0.381: 25.3,11.81 26.54,13.05 v2(26.54,13.59) ; 35.99,11.81 37.08,12.9 v2(37.08,13.59) ; v2(16.26,13.97) 16.26,13.34 14.73,11.81
  Bottom Layer w0.66: v1(43.94,7.49) 39.62,11.81 9.27,11.81 4.57,7.11 4.06,7.11
  vias: v2(2.67,7.06) v2(2.67,0.89) v2(3.75,0.89) v2(4.83,0.89)
GND: length 56
  Top Layer w0.254: LED4.3 23.3,26.61 v2(23.34,26.57) ; C46.2 38.92,34.93 v2(38.86,34.93) ; C44.2 40.45,44.96 v2(39.12,44.96) ; v2(13.08,18.29) 13.08,19.8 LED2.3 ; LED9.3 34.58,10.5 v2(35.18,9.91) ; C48.2 40.2,28.19 v2(40.43,28.19) ; v2(12.19,28.07) 12.19,28.32 12.82,28.95 12.82,29.23 LED1.3 ; v2(40.77,19.18) 40.77,19.5 C51.1 ; C47.2 39.31,32.26 v2(38.86,32.26) ; C45.2 40.83,40.01 v2(41.15,40.01) ; C52.2 20.69,29.34 v2(20.7,29.34) ; v2(28.07,8.13) 28.96,7.24 R16.1 ; v2(33.53,27.18) 33.65,27.3 LED7.3 ; v2(33.66,18.29) 33.66,19.93 ; v2(40.26,22.34) 40.26,23.43 C49.2 ; v2(24.51,0.64) 25.19,0.64 25.83,1.27 R15.1 ; C50.2 30.29,30.03 v2(31.37,28.96) ; LED5.3 23.3,18.6 v2(22.99,18.29) ; LED6.3 23.3,12.51 v2(23.75,12.95) ; v2(13.34,8.76) 12.95,9.15 LED3.3
  Top Layer w0.381: R26.1 48.39,4.2 Battery.2 ; v2(12.73,46.86) 13.91,46.86 C3.1 ; C1.1 15.24,44.89 v2(15.24,45.21) ; v2(45.34,10.8) 45.02,11.11 U2.1 ; C2.1 12.06,45.91 v2(12.06,46.36)
  Top Layer w0.66: v1(24.76,6.48) 23.69,7.56 23.24,7.56 ; v1(0.76,27.94) 1.02,28.19 R24.1 ; v1(37.59,7.37) 38.13,6.83 38.13,5.84 ; v1(31.75,7.11) 32.73,6.13 32.73,5.84 ; v1(24.51,5.21) 24.51,4 C15.2
  vias: v1(1.02,6.99) v1(1.14,1.02) v1(19.3,38.1) v1(19.3,36.83) v1(20.83,38.1) v1(20.83,36.83) v2(7.19,4.7) v2(7.19,3.02) v2(7.47,3.83) v2(7.91,4.5) v2(7.91,3.16) v2(8.38,3.83) v2(8.64,4.7) v2(8.76,3.02) v2(19,11.02) v2(20.7,11.02) v2(40.31,7.46) v2(40.99,14.76) v2(41.45,8.64) v2(41.66,17.31)
VCC: length 29.2
  Top Layer w0.254: Q3.1 6.91,10.16 v2(6.35,10.16) ; Q2.1 5.97,26.11 v2(5.97,27.18) ; v2(44.96,29.21) 44.96,29.19 RN3.5 RN3.6 ; v2(3.43,32.77) 3.66,32.77 4.72,31.71 R20.1 ; R22.1 2.16,12.15 v2(2.16,12.19) ; R18.1 8.34,31.71 9.14,32.51 v2(9.14,33.15) ; RN2.6 RN2.5 43.18,34.13 43.18,34.8 v2(43.62,35.24) ; v2(44.58,45.99) 44.58,45.69 RN1.5 RN1.6 ; Q1.1 9.71,26.99 v2(10.67,27.94)
  Top Layer w0.381: v2(46.35,7.86) 46.38,7.86 R25.2 ; v2(12.7,36.45) 14.18,36.45 R2.1
  Bottom Layer w0.381: v2(44.58,16.64) 44.58,10.01 46.35,8.23 v2(46.35,7.86)
  vias: v2(8.43,46.99) v2(9.74,46.99) v2(11.05,46.99) v2(12.89,49.14) v2(15.49,49.15) v2(44.83,18.29) v2(46.1,16.64) v2(47.62,16.64)
VIN: length 33.6
  Top Layer w0.66: U1.1 12.18,0.63 17.01,0.63 18.17,1.79 18.17,3.89 22.59,8.31 22.59,8.44 22.72,8.44 23.24,8.96 26.42,8.96 R14.1 26.72,9.02 34.42,9.02 36.19,7.24 36.19,7.21 36.76,6.63 36.76,6 36.93,5.84
ADC_2: length 24.1
  Top Layer w0.66: R24.2 1.27,30.98 1.27,34.93 5.6,39.26 5.6,39.37 6.85,40.63 6.97,40.63 6.98,40.64 12.57,40.64 16.23,44.3 ESP32-C3-WROOM-02.4
B+: length 89.7
  Top Layer w0.66: v1(6.03,4.89) 5.72,4.57 U1.6 ; C42.1 C43.1 16.07,6.99 L1.2 ; 3.56,24.89 2.33,23.67 R19.1 ; 3.56,24.89 2.16,26.29 2.16,28.84 R23.2 ; 3.56,24.89 5.97,24.89 7.28,23.58 R17.1 9.91,19.22 v1(9.91,18.42) ; 15.82,3.94 15.11,4.64 15.11,11.68 v1(13.21,13.59) ; v1(14.35,5.72) 14.35,4.9 15.56,3.68
  Bottom Layer w0.66: v1(9.91,18.42) 13.21,15.11 v1(13.21,13.59) ; v1(6.03,4.89) 6.86,5.72 v1(14.35,5.72) 17.15,5.72 19.56,3.3 44.2,3.3 45.85,1.65
BTN0: length 27.5
  Top Layer w0.254: v2(39.12,43.69) 40.32,43.69 C44.1 43.31,43.24 RN1.7 ; ESP32-C3-WROOM-02.3 v2(18.67,45.8)
  Bottom Layer w0.254: v2(18.67,45.8) 37,45.8 v2(39.12,43.69)
BTN1: length 27.5
  Top Layer w0.254: RN1.8 42.69,41.4 C45.1 39.93,42.31 v2(39.12,42.31) ; ESP32-C3-WROOM-02.6 18.77,41.3 v2(18.8,41.28) 21.59,41.28 v2(22.61,42.29)
  Bottom Layer w0.254: v2(22.61,42.29) 22.62,42.31 v2(39.12,42.31)
BTN2: length 30.3
  Top Layer w0.254: RN2.7 42.76,32.49 C46.1 39.69,35.56 v2(39.62,35.56) ; ESP32-C3-WROOM-02.5 v2(18.8,42.8)
  Bottom Layer w0.254: v2(39.62,35.56) 33.53,41.66 22.35,41.66 21.21,42.8 v2(18.8,42.8)
BTN3: length 23.6
  Top Layer w0.254: v2(37.59,48.19) 36.7,47.3 ESP32-C3-WROOM-02.17 ; v2(41.78,32.64) 41.34,32.2 C47.1 43.07,31.62 RN2.8
  Bottom Layer w0.254: v2(41.78,32.64) 41.78,44 v2(37.59,48.19)
BTN4: length 26.6
  Top Layer w0.254: 41.87,29.08 40.85,30.1 v2(40.64,30.1) ; 41.87,29.08 39.69,29.08 C48.1 ; 41.87,29.08 42.4,28.55 RN3.7 ; ESP32-C3-WROOM-02.16 35.29,46.43 v2(36.96,46.43)
  Bottom Layer w0.254: v2(40.64,30.1) 40.51,30.23 40.51,35.81 40,36.32 40,45.09 38.66,46.43 v2(36.96,46.43)
BTN5: length 17.7
  Top Layer w0.254: v2(36.19,36.83) 36.16,36.8 ESP32-C3-WROOM-02.10 ; v2(38.35,26.92) 38.35,26.74 C49.1 40.64,26.74 40.64,27.27 RN3.8
  Bottom Layer w0.254: v2(36.19,36.83) 38.28,34.75 38.28,34.68 38.35,34.61 38.35,32.58 38.28,32.5 38.28,32.02 38.35,31.94 v2(38.35,26.92)
DI_PIN: length 34.5
  Top Layer w0.254: LED1.4 16.25,31.36 17.54,32.65 v2(21.43,32.65) ; v2(23.24,37.34) 23.24,46.18 25.14,48.08 33.98,48.08 34.66,48.76 ESP32-C3-WROOM-02.18
  Bottom Layer w0.254: v2(21.43,32.65) 23.24,34.46 v2(23.24,37.34)
EN: length 22.5
  Top Layer w0.381: 12.91,43.96 C1.2 14.1,45.21 15.88,46.99 16.85,46.99 ESP32-C3-WROOM-02.2 ; 12.91,43.96 10.06,43.96 R1.1 7.19,45.38 EN_SW.2 ; 12.91,43.96 10.73,41.78 C21.2
INT: length 3.2
  Top Layer w0.254: U1.4 10.78,7.64 Q3.3
INT_3V3: length 54.6
  Top Layer w0.254: v2(27.56,36.7) 31.75,40.89 34.25,40.89 ESP32-C3-WROOM-02.13 ; Q3.2 4.15,11.03 R22.2 4.37,11.18 4.63,11.43 4.63,19.1 v2(5.46,19.94)
  Bottom Layer w0.254: v2(27.56,36.7) 22.73,31.88 13.59,31.88 5.46,23.75 v2(5.46,19.94)
SCL: length 23.5
  Top Layer w0.254: U1.2 11.18,3.3 12.06,4.19 12.06,20.02 R17.2 10.24,23.15 Q1.3
SCL_3V3: length 35.8
  Top Layer w0.254: Q1.2 8.13,27.25 R18.2 10.03,30.65 10.03,33.27 12.06,35.31 23.75,35.31 26.42,37.97 28.19,37.97 33.02,42.8 ESP32-C3-WROOM-02.14
SDA: length 22.5
  Top Layer w0.254: Q2.3 5.29,23.41 R19.2 5.29,21.51 11.68,15.11 11.68,5.21 11.05,4.57 U1.3
SDA_3V3: length 41.6
  Top Layer w0.254: ESP32-C3-WROOM-02.15 34.01,44.3 28.19,38.48 26.03,38.48 23.37,35.81 8.25,35.81 6.6,34.16 6.6,30.1 5.25,28.75 R20.2 5.08,27.12 Q2.2
$1N2784: length 2.7
  Top Layer w0.381: ESP32-C3-WROOM-02.7 17.06,39.71 R2.2
$1N4891: length 13.8
  Top Layer w0.381: ESP32-C3-WROOM-02.8 16.85,38.61 13.34,38.61 11.94,40.01 7.11,40.01 6.22,39.12 BOOT.1
$1N6349: length 18.7
  Top Layer w0.66: 21.26,3.68 20.96,3.37 20.96,2.16 v1(20.19,1.4) ; v1(5.97,2.79) 5.46,3.3 U1.7
  Bottom Layer w0.66: v1(20.19,1.4) 19.46,2.13 6.63,2.13 v1(5.97,2.79)
$1N6507: length 3.3
  Top Layer w0.254: R13.2 4.97,7.94 U1.5
$1N6541: length 5.5
  Top Layer w0.254: SW7.1 3.17,13.08 3.17,11.05 1.78,9.65 1.78,9.35 R13.1
$1N6731: length 2.1
  Top Layer w0.66: R14.2 26.42,4.13 C15.1
$1N8374: length 9.2
  Top Layer w0.254: R15.2 30.82,3.56 34.04,3.56 35.93,5.45 35.93,5.84
$1N8380: length 7.1
  Top Layer w0.254: 28.78,3.94 33.38,3.94 34.93,5.49 34.93,5.84
$1N10278: length 4.1
  Top Layer w0.381: U2.2 43.81,10.16 43.18,10.8 43.18,11.81 43.94,12.57 44.7,12.57
$1N10381: length 5.4
  Top Layer w0.381: U2.4 46.49,8.76 47.31,7.94 47.31,7.94 47.51,7.74 47.51,7.74 47.56,7.69 48.26,7.69 48.89,7.06 R25.1 R26.2
$1N10452: length 3.4
  Top Layer w0.381: C27.1 48.51,9.53 46.93,11.11 U2.6
$1N11511: length 15.7
  Top Layer w0.254: LED4.2 24.13,33.43 24.13,22.61 26.6,20.14 LED5.4
$1N11517: length 15.7
  Top Layer w0.254: LED5.2 23.3,22.8 25.82,20.28 25.82,13.49 26.6,12.71 LED6.4
$1N11524: length 25
  Top Layer w0.254: LED6.2 25.02,17.12 v2(25.02,20.07) ; v2(36.7,27.94) 36.95,28.19 LED7.4
  Bottom Layer w0.254: v2(36.7,27.94) 27.43,27.94 25.02,25.53 v2(25.02,20.07)
$1N11575: length 15.7
  Top Layer w0.254: LED7.2 34.8,33.11 34.8,22.35 36.95,20.2 LED8.4
$1N11589: length 15.7
  Top Layer w0.254: LED9.4 36.95,10.93 34.42,13.46 34.42,14.52 34.43,14.54 34.43,16.27 34.42,16.29 34.42,19.05 34.43,19.07 34.43,24.05 LED8.2
$1N11601: length 15.7
  Top Layer w0.254: LED1.2 14.99,32.22 14.99,21.46 16.25,20.2 LED2.4
$1N11617: length 15.7
  Top Layer w0.254: LED3.4 16.25,11.57 15.24,12.57 15.24,20.71 14.63,21.32 14.63,23.15 LED2.2
$1N11630: length 24.2
  Top Layer w0.254: v2(14.35,18.42) 14.35,16.81 LED3.2 ; v2(25.27,27.74) 26.6,29.07 LED4.4
  Bottom Layer w0.254: v2(25.27,27.74) 17.45,27.74 14.35,24.64 v2(14.35,18.42)
$1N11984: length 18.2
  Top Layer w0.254: ESP32-C3-WROOM-02.11 35.17,38.81 37.03,38.81 38.33,40.11 38.33,45.06 40,46.74 43.69,46.74 45.21,48.26 UART.2
$1N11989: length 14.9
  Top Layer w0.254: ESP32-C3-WROOM-02.12 34.71,39.75 37.21,39.75 37.97,40.51 37.97,45.21 39.88,47.12 42.16,47.12 UART.3
$1N25047: length 10.1
  Top Layer w0.254: RN1.3 45.7,43.83 45.97,43.56 45.97,42.8 45.41,42.23 RN1.1 47.12,40.24 47.12,39.4 47.11,39.39 47.11,38.33 47.12,38.32 47.12,37.59 BTN1.1
$1N25198: length 7
  Top Layer w0.254: RN1.2 44.72,43.03 44.44,43.31 44.44,44.2 44.61,44.36 44.85,44.36 RN1.4 45.41,44.63 BTN0.1
$1N27953: length 10.1
  Top Layer w0.254: RN2.3 45.07,33.29 45.47,32.89 45.47,32.13 45.03,31.69 RN2.1 46.99,29.45 46.99,27.05 BTN3.1
$1N27956: length 7.6
  Top Layer w0.254: BTN2.1 45.28,34.09 RN2.4 44.47,33.82 44.23,33.82 43.94,33.54 43.94,32.89 44.34,32.49 RN2.2
$1N28261: length 8.1
  Top Layer w0.254: 41.91,25.91 41.4,25.4 41.4,22.73 42.8,21.34 ; 41.91,25.91 41.53,26.29 41.53,26.56 RN3.1 ; 41.91,25.91 42.8,25.91 43.2,26.31 RN3.3
$1N28264: length 5.8
  Top Layer w0.254: 42.8,24.26 42.86,24.26 44,25.4 RN3.4 44,27.25 43.81,27.43 42.67,27.43 42.4,27.16 RN3.2

## Copper pours and planes (outline as drawn; the poured copper is in the pictures)
+5V on Top Layer: 44.55,8.51 45.62,8.51 45.62,6.3 44.55,6.3
+5V on Top Layer: 43.44,9.51 45.65,9.51 45.65,6.35 43.44,6.35
+5V on Top Layer: 2.16,7.51 5.49,7.51 5.49,0.38 2.16,0.38
+5V on Bottom Layer: 2.03,7.73 5.7,7.73 5.7,0.35 2.03,0.35
GND on Top Layer: 17.45,11.56 21.08,11.56 21.08,9.91 17.45,9.91
GND on Top Layer: 0.38,49.53 2.29,49.53 2.29,36.44 0.38,36.44
GND on Top Layer: 39.73,19.22 42.26,19.22 42.26,13.45 39.73,13.45
GND on Top Layer: 39.88,9.02 42.19,9.02 42.19,6.35 39.88,6.35
GND on Top Layer: 18.03,38.86 21.46,38.86 21.46,36.32 18.03,36.32
GND on Top Layer: 0.38,7.49 1.78,7.49 1.78,0.5 0.38,0.5
GND on Inner2: 0,49.91 50,49.91 50,0 0,0
VCC on Top Layer: 7.11,49.53 16.51,49.53 16.51,46.48 7.11,46.48
VCC on Top Layer: 42.04,15.67 43.69,15.67 43.69,13.13 42.04,13.13
VCC on Top Layer: 42.67,19.56 48.39,19.56 48.39,13.21 42.67,13.21
VCC on Inner1: 0,49.91 50,49.91 50,0 0,0
VIN on Top Layer: 31.5,8.76 36.45,8.76 36.45,5.71 31.5,5.71
ADC_2 on Top Layer: 0.76,32.21 2.82,32.21 2.82,30.35 0.76,30.35
B+ on Top Layer: 16.83,9.65 20.65,9.65 20.65,7.62 16.83,7.62
B+ on Top Layer: 1.91,26.29 3.3,26.29 3.3,23.62 1.91,23.62
B+ on Top Layer: 13.84,8.92 17.44,8.92 17.44,3.05 13.84,3.05
$1N10278 on Top Layer: 44.32,15.75 49.61,15.75 49.61,11.11 44.32,11.11

## Text on the board
Bottom Silkscreen Layer: @EnginEar_Proto
Top Silkscreen Layer: GND | TX | RX | VCC | SCL | SDA | INT | B+
